# EAGLE schematic dmfboard (EAGLE 6.6.0)
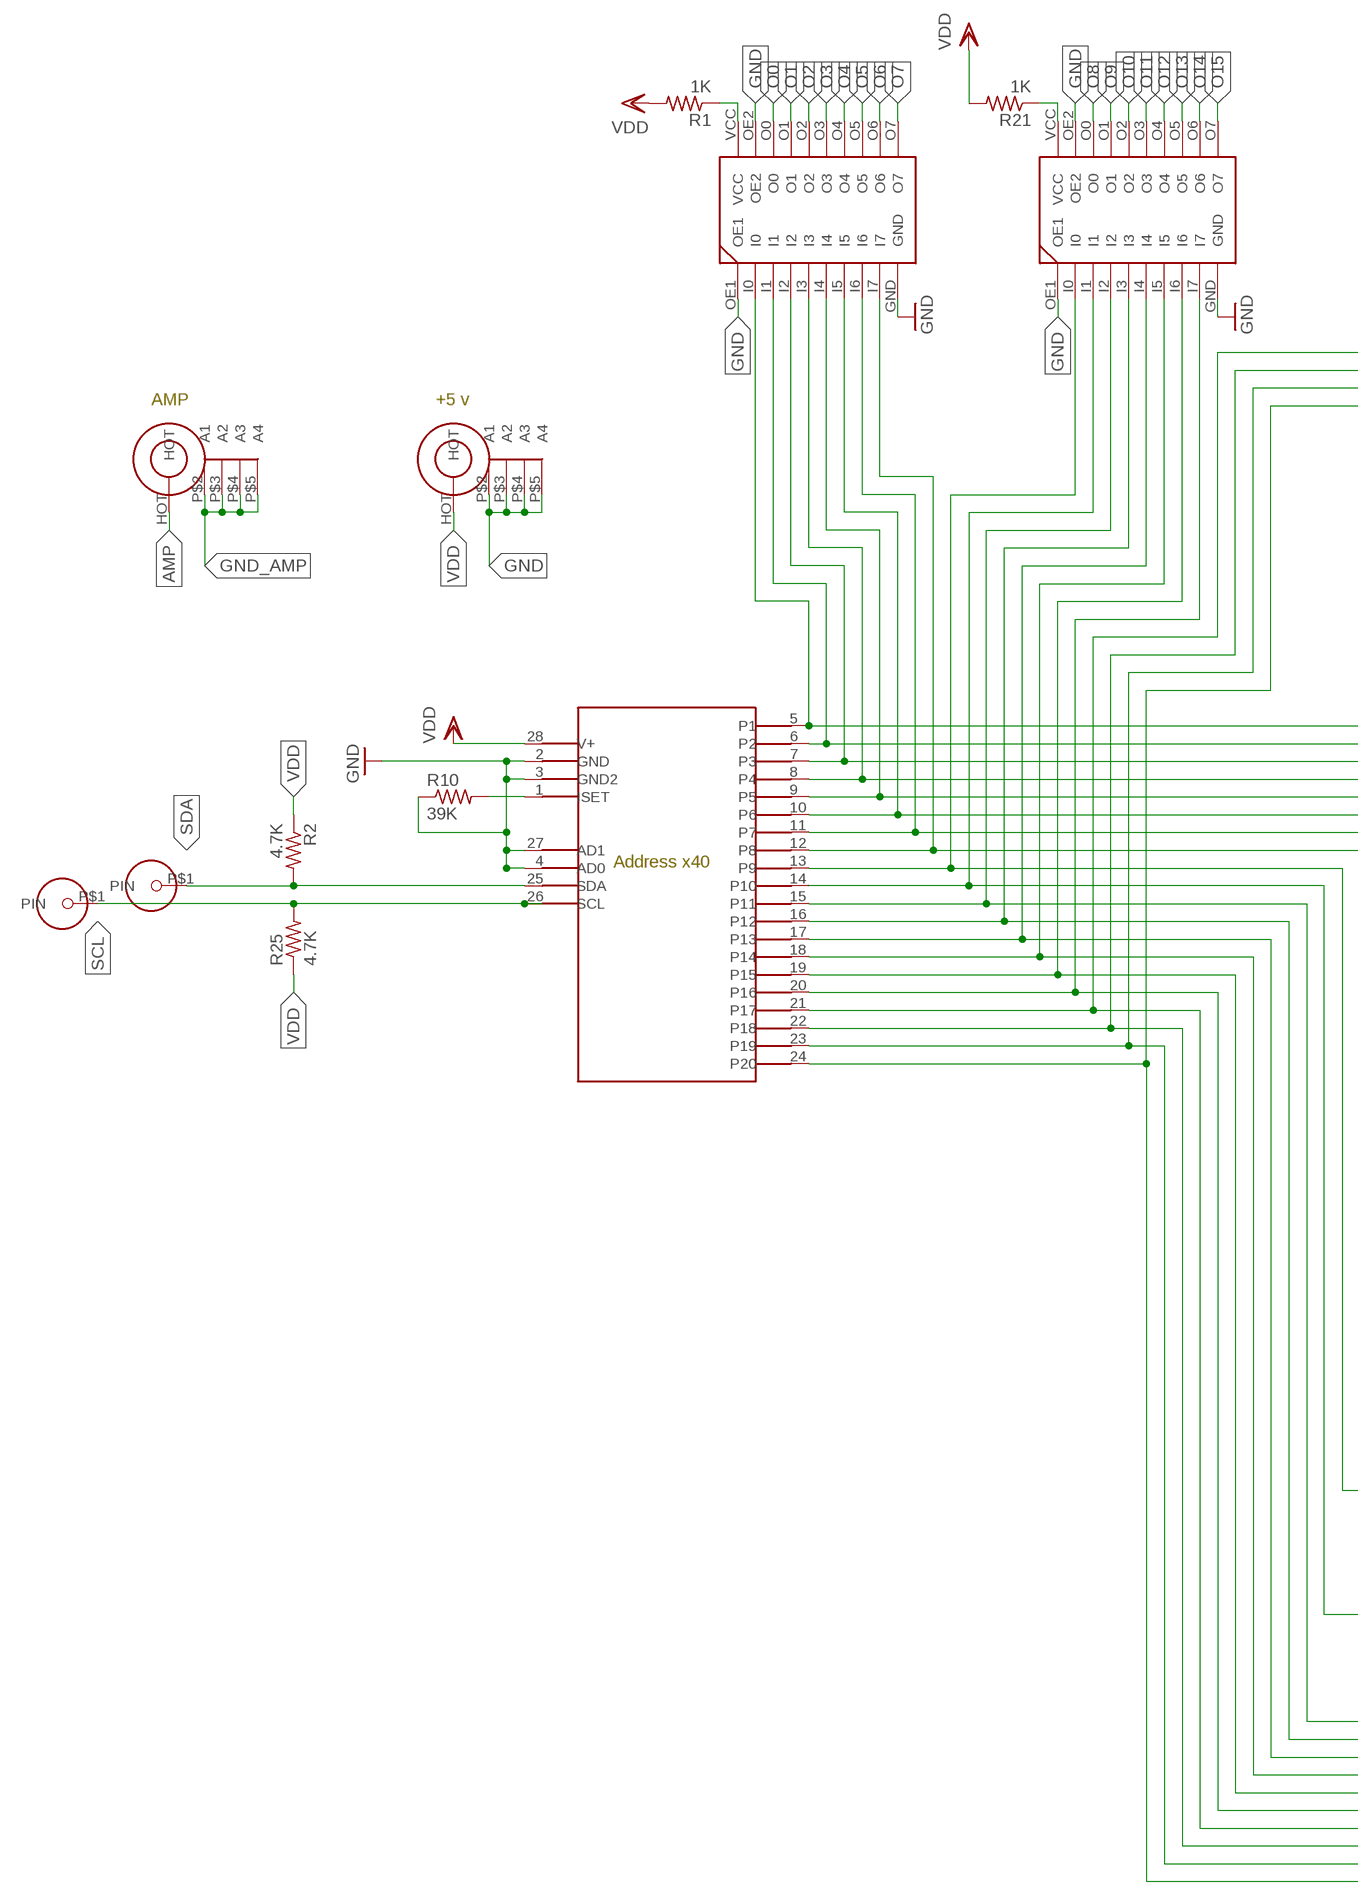
[diagram p0: schematic, sheet 1, part 1 of 2]
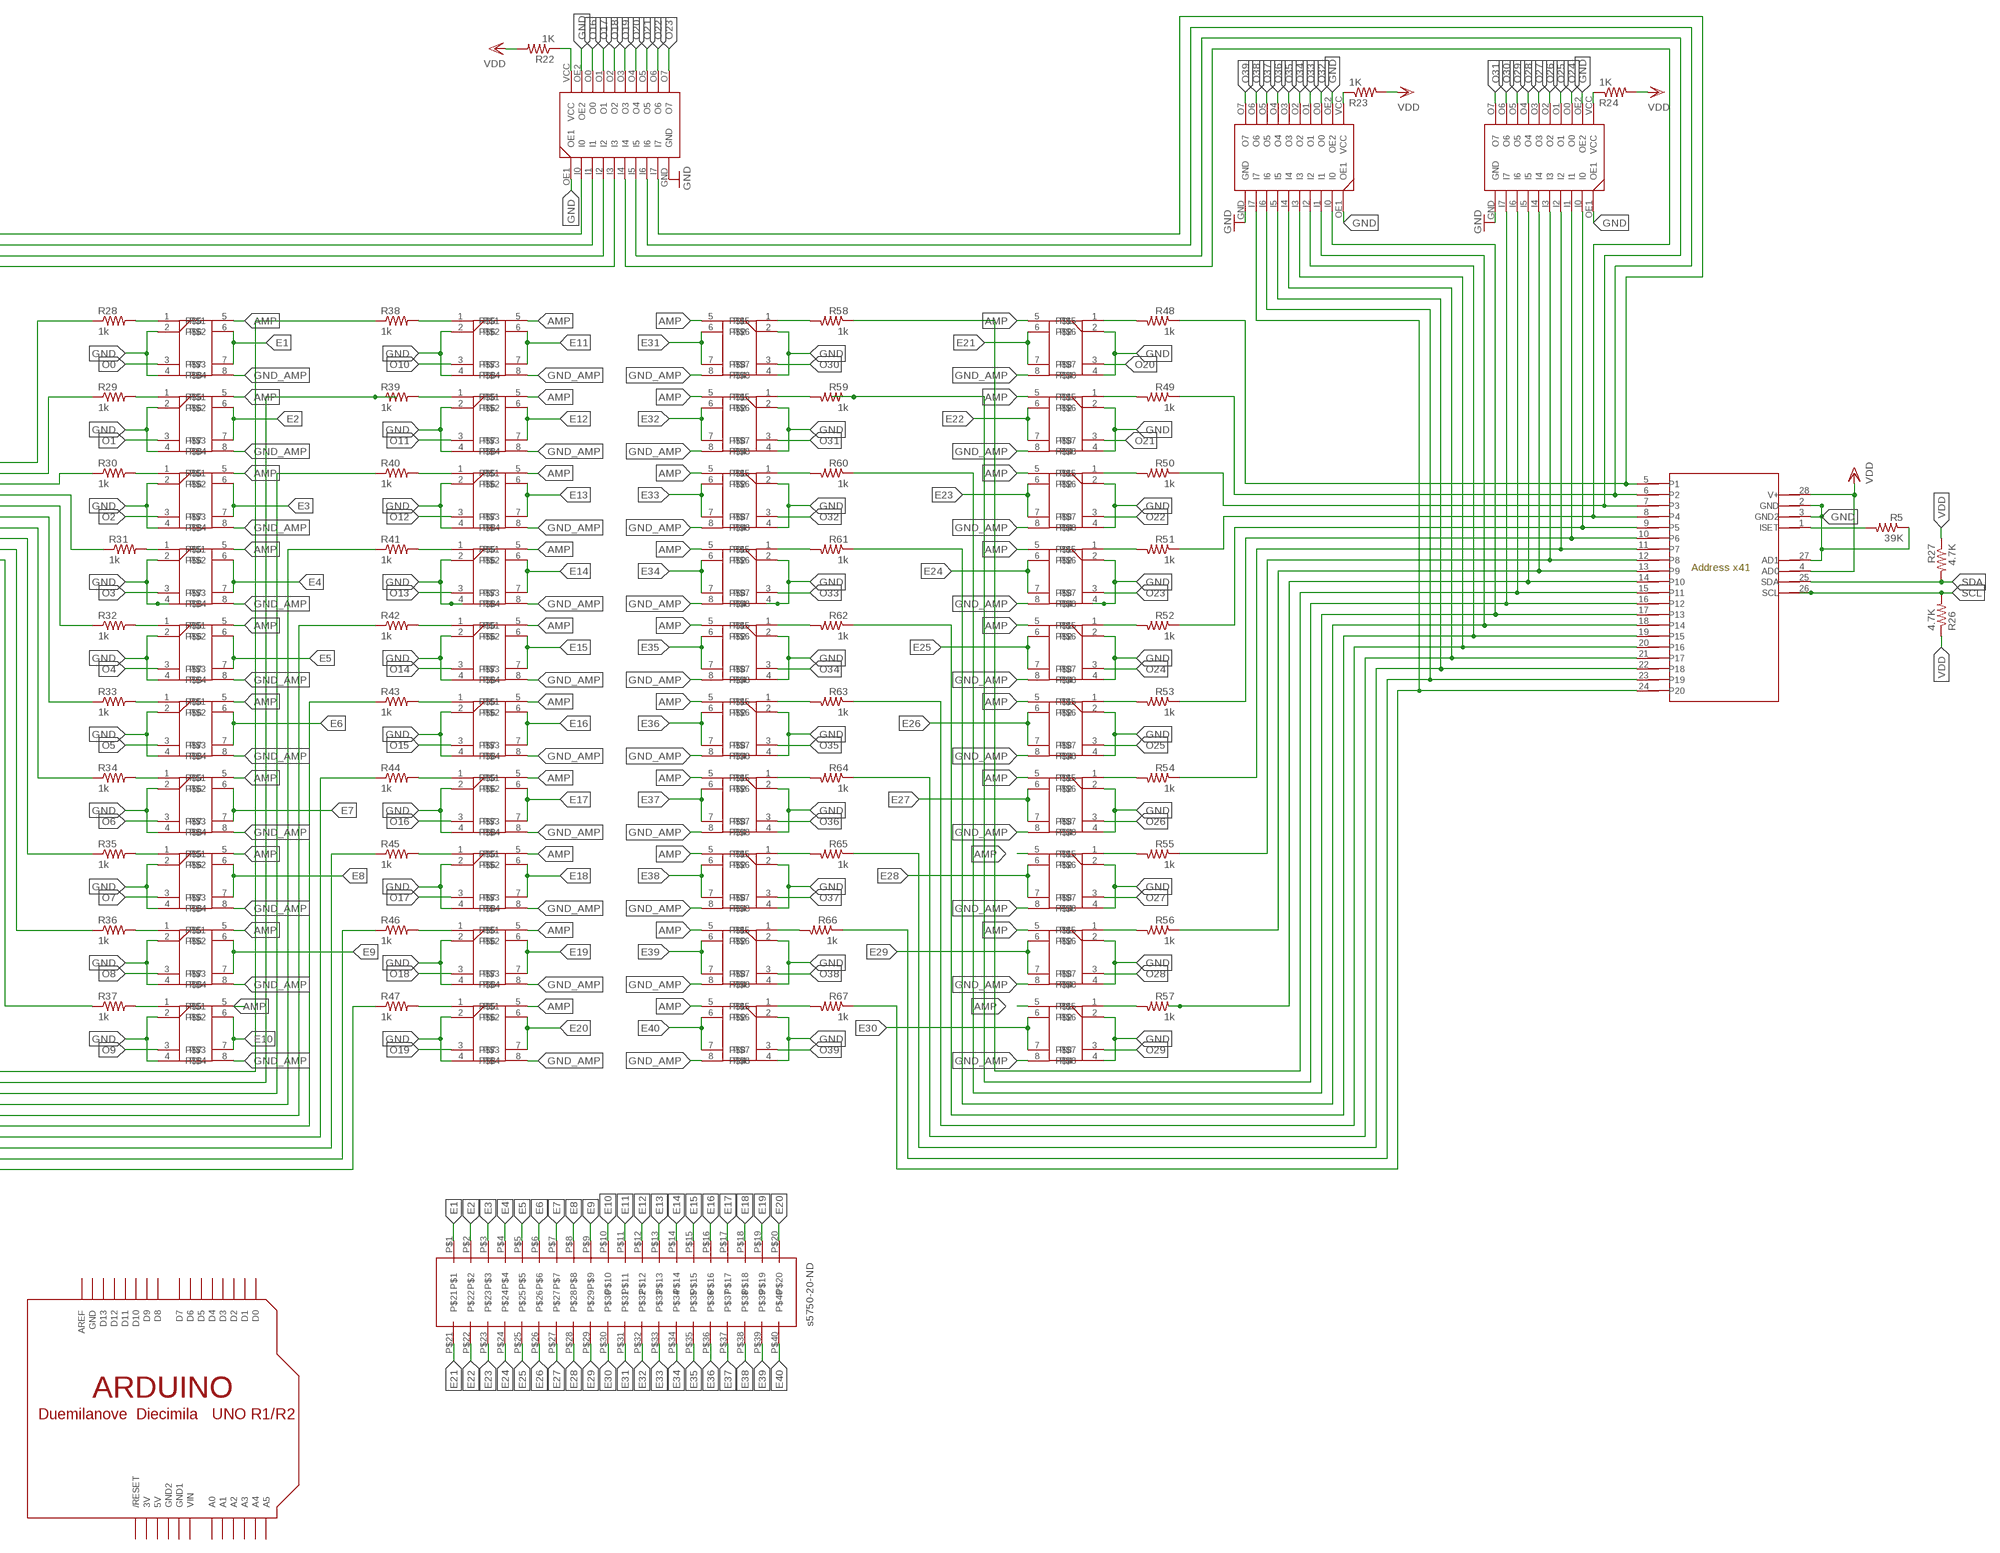
[diagram p1: schematic, sheet 1, part 2 of 2]

## Parts
+5V  BNC-BNC  [BNC-BNC]
AMP  BNC-BNC  [BNC-BNC]
INVERTOR1  74AC540  [SO20W]
INVERTOR2  74AC540  [SO20W]
INVERTOR3  74AC540  [SO20W]
INVERTOR4  74AC540  [SO20W]
INVERTTOR5  74AC540  [SO20W]
MAX1  MAX7300  [QSOP24]
MAX2  MAX7300  [QSOP24]
P1  AQW21  [AQW216EH]
P2  AQW21  [AQW216EH]
P3  AQW21  [AQW216EH]
P4  AQW21  [AQW216EH]
P5  AQW21  [AQW216EH]
P6  AQW21  [AQW216EH]
P7  AQW21  [AQW216EH]
P8  AQW21  [AQW216EH]
P9  AQW21  [AQW216EH]
P10  AQW21  [AQW216EH]
P11  AQW21  [AQW216EH]
P12  AQW21  [AQW216EH]
P13  AQW21  [AQW216EH]
P14  AQW21  [AQW216EH]
P15  AQW21  [AQW216EH]
P16  AQW21  [AQW216EH]
P17  AQW21  [AQW216EH]
P18  AQW21  [AQW216EH]
P19  AQW21  [AQW216EH]
P20  AQW21  [AQW216EH]
P21  AQW21  [AQW216EH]
P22  AQW21  [AQW216EH]
P23  AQW21  [AQW216EH]
P24  AQW21  [AQW216EH]
P25  AQW21  [AQW216EH]
P26  AQW21  [AQW216EH]
P27  AQW21  [AQW216EH]
P28  AQW21  [AQW216EH]
P29  AQW21  [AQW216EH]
P30  AQW21  [AQW216EH]
P31  AQW21  [AQW216EH]
P32  AQW21  [AQW216EH]
P33  AQW21  [AQW216EH]
P34  AQW21  [AQW216EH]
P35  AQW21  [AQW216EH]
P36  AQW21  [AQW216EH]
P37  AQW21  [AQW216EH]
P38  AQW21  [AQW216EH]
P39  AQW21  [AQW216EH]
P40  AQW21  [AQW216EH]
R1  1K  R-US_M0805  [M0805]
R2  4.7K  R-US_M0805  [M0805]
R5  39K  R-US_M0805  [M0805]
R10  39K  R-US_M0805  [M0805]
R21  1K  R-US_M0805  [M0805]
R22  1K  R-US_M0805  [M0805]
R23  1K  R-US_M0805  [M0805]
R24  1K  R-US_M0805  [M0805]
R25  4.7K  R-US_M0805  [M0805]
R26  4.7K  R-US_M0805  [M0805]
R27  4.7K  R-US_M0805  [M0805]
R28  1k  R-US_M0805  [M0805]
R29  1k  R-US_M0805  [M0805]
R30  1k  R-US_M0805  [M0805]
R31  1k  R-US_M0805  [M0805]
R32  1k  R-US_M0805  [M0805]
R33  1k  R-US_M0805  [M0805]
R34  1k  R-US_M0805  [M0805]
R35  1k  R-US_M0805  [M0805]
R36  1k  R-US_M0805  [M0805]
R37  1k  R-US_M0805  [M0805]
R38  1k  R-US_M0805  [M0805]
R39  1k  R-US_M0805  [M0805]
R40  1k  R-US_M0805  [M0805]
R41  1k  R-US_M0805  [M0805]
R42  1k  R-US_M0805  [M0805]
R43  1k  R-US_M0805  [M0805]
R44  1k  R-US_M0805  [M0805]
R45  1k  R-US_M0805  [M0805]
R46  1k  R-US_M0805  [M0805]
R47  1k  R-US_M0805  [M0805]
R48  1k  R-US_M0805  [M0805]
R49  1k  R-US_M0805  [M0805]
R50  1k  R-US_M0805  [M0805]
R51  1k  R-US_M0805  [M0805]
R52  1k  R-US_M0805  [M0805]
R53  1k  R-US_M0805  [M0805]
R54  1k  R-US_M0805  [M0805]
R55  1k  R-US_M0805  [M0805]
R56  1k  R-US_M0805  [M0805]
R57  1k  R-US_M0805  [M0805]
R58  1k  R-US_M0805  [M0805]
R59  1k  R-US_M0805  [M0805]
R60  1k  R-US_M0805  [M0805]
R61  1k  R-US_M0805  [M0805]
R62  1k  R-US_M0805  [M0805]
R63  1k  R-US_M0805  [M0805]
R64  1k  R-US_M0805  [M0805]
R65  1k  R-US_M0805  [M0805]
R66  1k  R-US_M0805  [M0805]
R67  1k  R-US_M0805  [M0805]
SCL  TH_HOLE  [TH_PIN]
SDA  TH_HOLE  [TH_PIN]
U$1  ARDUINO-NODIM  [ARDUINO-NODIM]
U$50  S5750_20_ND40PIN_CONNECTOR  [S5750-20_ND]

## Nets
AMP: AMP.HOT P1.5 P2.5 P3.5 P4.5 P5.5 P6.5 P7.5 P8.5 P9.5 P10.5 P11.5 P12.5 P13.5 P14.5 P15.5 P16.5 P17.5 P18.5 P19.5 P20.5 P21.5 P22.5 P23.5 P24.5 P25.5 P26.5 P27.5 P28.5 P29.5 P30.5 P31.5 P32.5 P33.5 P34.5 P35.5 P36.5 P37.5 P38.5 P39.5 P40.5
E1: P1.6 P1.7 U$50.P$1
E2: P2.6 P2.7 U$50.P$2
E3: P3.6 P3.7 U$50.P$3
E4: P4.6 P4.7 U$50.P$4
E5: P5.6 P5.7 U$50.P$5
E6: P6.6 P6.7 U$50.P$6
E7: P7.6 P7.7 U$50.P$7
E8: P8.6 P8.7 U$50.P$8
E9: P9.6 P9.7 U$50.P$9
E10: P10.6 P10.7 U$50.P$10
E11: P11.6 P11.7 U$50.P$11
E12: P12.6 P12.7 U$50.P$12
E13: P13.6 P13.7 U$50.P$13
E14: P14.6 P14.7 U$50.P$14
E15: P15.6 P15.7 U$50.P$15
E16: P16.6 P16.7 U$50.P$16
E17: P17.6 P17.7 U$50.P$17
E18: P18.6 P18.7 U$50.P$18
E19: P19.6 P19.7 U$50.P$19
E20: P20.6 P20.7 U$50.P$20
E21: P21.6 P21.7 U$50.P$21
E22: P22.6 P22.7 U$50.P$22
E23: P23.6 P23.7 U$50.P$23
E24: P24.6 P24.7 U$50.P$24
E25: P25.6 P25.7 U$50.P$25
E26: P26.6 P26.7 U$50.P$26
E27: P27.6 P27.7 U$50.P$27
E28: P28.6 P28.7 U$50.P$28
E29: P29.6 P29.7 U$50.P$29
E30: P30.6 P30.7 U$50.P$30
E31: P31.6 P31.7 U$50.P$31
E32: P32.6 P32.7 U$50.P$32
E33: P33.6 P33.7 U$50.P$33
E34: P34.6 P34.7 U$50.P$34
E35: P35.6 P35.7 U$50.P$35
E36: P36.6 P36.7 U$50.P$36
E37: P37.6 P37.7 U$50.P$37
E38: P38.6 P38.7 U$50.P$38
E39: P39.6 P39.7 U$50.P$39
E40: P40.6 P40.7 U$50.P$40
GND: +5V.P$2(A1) +5V.P$3(A2) +5V.P$4(A3) +5V.P$5(A4) INVERTOR1.GND INVERTOR1.OE1 INVERTOR1.OE2 INVERTOR2.GND INVERTOR2.OE1 INVERTOR2.OE2 INVERTOR3.GND INVERTOR3.OE1 INVERTOR3.OE2 INVERTOR4.GND INVERTOR4.OE1 INVERTOR4.OE2 INVERTTOR5.GND INVERTTOR5.OE1 INVERTTOR5.OE2 MAX1.2(GND) MAX1.3(GND2) MAX1.4(AD0) MAX1.27(AD1) MAX2.2(GND) MAX2.3(GND2) MAX2.27(AD1) P1.2 P1.4 P2.2 P2.4 P3.2 P3.4 P4.2 P4.4 P5.2 P5.4 P6.2 P6.4 P7.2 P7.4 P8.2 P8.4 P9.2 P9.4 P10.2 P10.4 P11.2 P11.4 P12.2 P12.4 P13.2 P13.4 P14.2 P14.4 P15.2 P15.4 P16.2 P16.4 P17.2 P17.4 P18.2 P18.4 P19.2 P19.4 P20.2 P20.4 P21.2 P21.4 P22.2 P22.4 P23.2 P23.4 P24.2 P24.4 P25.2 P25.4 P26.2 P26.4 P27.2 P27.4 P28.2 P28.4 P29.2 P29.4 P30.2 P30.4 P31.2 P31.4 P32.2 P32.4 P33.2 P33.4 P34.2 P34.4 P35.2 P35.4 P36.2 P36.4 P37.2 P37.4 P38.2 P38.4 P39.2 P39.4 P40.2 P40.4 R5.1 R10.1
GND_AMP: AMP.P$2(A1) AMP.P$3(A2) AMP.P$4(A3) AMP.P$5(A4) P1.8 P2.8 P3.8 P4.8 P5.8 P6.8 P7.8 P8.8 P9.8 P10.8 P11.8 P12.8 P13.8 P14.8 P15.8 P16.8 P17.8 P18.8 P19.8 P20.8 P21.8 P22.8 P23.8 P24.8 P25.8 P26.8 P27.8 P28.8 P29.8 P30.8 P31.8 P32.8 P33.8 P34.8 P35.8 P36.8 P37.8 P38.8 P39.8 P40.8
N$1: MAX2.1(ISET) R5.2
N$2: MAX1.1(ISET) R10.2
N$3: INVERTOR1.VCC R1.1
N$4: INVERTOR2.VCC R21.1
N$5: INVERTOR3.VCC R22.1
N$6: INVERTOR4.VCC R23.1
N$7: INVERTTOR5.VCC R24.1
N$28: P10.1 R37.2
N$29: P9.1 R36.2
N$30: P8.1 R35.2
N$31: P7.1 R34.2
N$32: P6.1 R33.2
N$33: P5.1 R32.2
N$34: P4.1 R31.2
N$35: P3.1 R30.2
N$36: P2.1 R29.2
N$37: P1.1 R28.2
N$38: P11.1 R38.2
N$39: P12.1 R39.2
N$40: P13.1 R40.2
N$41: P14.1 R41.2
N$42: P15.1 R42.2
N$43: P16.1 R43.2
N$44: P17.1 R44.2
N$45: P18.1 R45.2
N$46: P19.1 R46.2
N$47: P20.1 R47.2
N$48: INVERTOR1.I0 MAX1.5(P1) R28.1
N$50: INVERTOR1.I2 MAX1.7(P3) R30.1
N$51: INVERTOR1.I3 MAX1.8(P4) R31.1
N$52: INVERTOR1.I4 MAX1.9(P5) R32.1
N$53: INVERTOR1.I5 MAX1.10(P6) R33.1
N$54: INVERTOR1.I6 MAX1.11(P7) R34.1
N$55: INVERTOR1.I7 MAX1.12(P8) R35.1
N$56: INVERTOR2.I0 MAX1.13(P9) R36.1
N$57: INVERTOR2.I1 MAX1.14(P10) R37.1
N$58: INVERTOR2.I2 MAX1.15(P11) R38.1
N$59: INVERTOR2.I3 MAX1.16(P12) R39.1
N$60: INVERTOR2.I4 MAX1.17(P13) R40.1
N$61: INVERTOR2.I5 MAX1.18(P14) R41.1
N$62: INVERTOR2.I6 MAX1.19(P15) R42.1
N$63: INVERTOR2.I7 MAX1.20(P16) R43.1
N$64: INVERTOR3.I0 MAX1.21(P17) R44.1
N$65: INVERTOR3.I1 MAX1.22(P18) R45.1
N$66: INVERTOR3.I2 MAX1.23(P19) R46.1
N$67: INVERTOR3.I3 MAX1.24(P20) R47.1
N$68: INVERTOR1.I1 MAX1.6(P2) R29.1
N$82: P21.1 R48.2
N$83: P22.1 R49.2
N$84: P23.1 R50.2
N$85: P24.1 R51.2
N$86: P25.1 R52.2
N$87: P26.1 R53.2
N$88: P27.1 R54.2
N$89: P28.1 R55.2
N$90: P29.1 R56.2
N$91: P30.1 R57.2
N$92: INVERTTOR5.I0 MAX2.9(P5) R52.1
N$103: P31.1 R58.2
N$104: P32.1 R59.2
N$105: P33.1 R60.2
N$106: P34.1 R61.2
N$107: P35.1 R62.2
N$108: P36.1 R63.2
N$109: P37.1 R64.2
N$110: P38.1 R65.2
N$111: P39.1 R66.2
N$112: P40.1 R67.2
N$113: INVERTTOR5.I7 MAX2.16(P12) R59.1
N$114: INVERTTOR5.I1 MAX2.10(P6) R53.1
N$115: INVERTTOR5.I2 MAX2.11(P7) R54.1
N$116: INVERTTOR5.I3 MAX2.12(P8) R55.1
N$117: INVERTTOR5.I4 MAX2.13(P9) R56.1
N$118: INVERTTOR5.I5 MAX2.14(P10) R57.1
N$119: INVERTTOR5.I6 MAX2.15(P11) R58.1
N$120: INVERTOR4.I2 MAX2.19(P15) R62.1
N$121: INVERTOR4.I0 MAX2.17(P13) R60.1
N$122: INVERTOR4.I1 MAX2.18(P14) R61.1
N$123: INVERTOR4.I3 MAX2.20(P16) R63.1
N$124: INVERTOR4.I4 MAX2.21(P17) R64.1
N$125: INVERTOR4.I5 MAX2.22(P18) R65.1
N$126: INVERTOR4.I6 MAX2.23(P19) R66.1
N$127: INVERTOR4.I7 MAX2.24(P20) R67.1
N$128: INVERTOR3.I7 MAX2.5(P1) R48.1
N$129: INVERTOR3.I6 MAX2.6(P2) R49.1
N$130: INVERTOR3.I5 MAX2.7(P3) R50.1
N$131: INVERTOR3.I4 MAX2.8(P4) R51.1
O0: INVERTOR1.O0 P1.3
O1: INVERTOR1.O1 P2.3
O2: INVERTOR1.O2 P3.3
O3: INVERTOR1.O3 P4.3
O4: INVERTOR1.O4 P5.3
O5: INVERTOR1.O5 P6.3
O6: INVERTOR1.O6 P7.3
O7: INVERTOR1.O7 P8.3
O8: INVERTOR2.O0 P9.3
O9: INVERTOR2.O1 P10.3
O10: INVERTOR2.O2 P11.3
O11: INVERTOR2.O3 P12.3
O12: INVERTOR2.O4 P13.3
O13: INVERTOR2.O5 P14.3
O14: INVERTOR2.O6 P15.3
O15: INVERTOR2.O7 P16.3
O16: INVERTOR3.O0 P17.3
O17: INVERTOR3.O1 P18.3
O18: INVERTOR3.O2 P19.3
O19: INVERTOR3.O3 P20.3
O20: INVERTOR3.O4 P21.3
O21: INVERTOR3.O5 P22.3
O22: INVERTOR3.O6 P23.3
O23: INVERTOR3.O7 P24.3
O24: INVERTTOR5.O0 P25.3
O25: INVERTTOR5.O1 P26.3
O26: INVERTTOR5.O2 P27.3
O27: INVERTTOR5.O3 P28.3
O28: INVERTTOR5.O4 P29.3
O29: INVERTTOR5.O5 P30.3
O30: INVERTTOR5.O6 P31.3
O31: INVERTTOR5.O7 P32.3
O32: INVERTOR4.O0 P33.3
O33: INVERTOR4.O1 P34.3
O34: INVERTOR4.O2 P35.3
O35: INVERTOR4.O3 P36.3
O36: INVERTOR4.O4 P37.3
O37: INVERTOR4.O5 P38.3
O38: INVERTOR4.O6 P39.3
O39: INVERTOR4.O7 P40.3
SCL: MAX1.26(SCL) MAX2.26(SCL) R25.2 R26.2 SCL.P$1(PIN)
SDA: MAX1.25(SDA) MAX2.25(SDA) R2.2 R27.2 SDA.P$1(PIN)
VDD: +5V.HOT MAX1.28(V+) MAX2.4(AD0) MAX2.28(V+) R1.2 R2.1 R21.2 R22.2 R23.2 R24.2 R25.1 R26.1 R27.1
Unconnected: U$1.A0 U$1.A1 U$1.A2 U$1.A3 U$1.A4 U$1.A5 U$1.AREF U$1.D0 U$1.D1 U$1.D2 U$1.D3 U$1.D4 U$1.D5 U$1.D6 U$1.D7 U$1.D8 U$1.D9 U$1.D10 U$1.D11 U$1.D12 U$1.D13 U$1.RESET(/RESET)

## Notes on the sheet
- AMP | +5 v
- Address x40
- Address x41

## Power pins joined to a net without a drawn wire
3V: U$1.3V
5V: U$1.5V
GND: U$1.GND
GND1: U$1.GND1
GND2: U$1.GND2
VIN: U$1.VIN

## Library data of the parts
+5V AMP = DMFlib:BNC-BNC
INVERTOR1-INVERTOR4 INVERTTOR5 = DMFlib:74AC540
MAX1 MAX2 = DMFlib:MAX7300
P1-P40 = DMFlib:AQW21
R1 R2 R5 R10 R21-R67 = resistor:R-US_: RESISTOR, American symbol
SCL SDA = DMFlib:TH_HOLE
U$1 = adafruit:ARDUINO: Arduino Diecimila/Duemilanove Make a shield with ease, this package has all the named pins as well as the two mounting drill holes and an outline of the USB and DC power connector. The outline is on the DIMENSION layer, so if your board house uses it they will cut the outline to match. http://www.ladyada.net/library/pcb/eaglelibrary.html
U$50 = DMFlib:S5750_20_ND40PIN_CONNECTOR